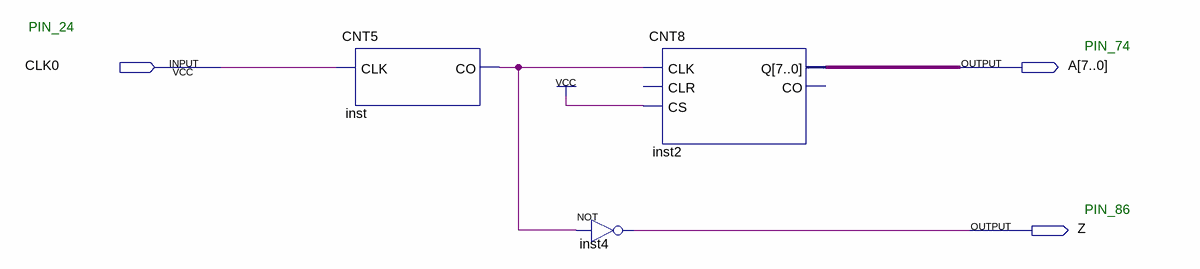
[diagram p0: schematic sheet]
// Quartus schematic sawtooth.bdf as structural Verilog: 3 symbols, 3 pins
module sawtooth (
  input  CLK0,
  output [7:0] A,
  output Z
);

  wire inst_co;

  CNT5 inst (.CLK(CLK0), .CO(inst_co));
  not inst4 (Z, inst_co);
  CNT8 inst2 (.CLK(inst_co), .CS(1'b1), .Q(A));  // open: CLR, CO

  // Notes on the sheet:
  //   PIN_24 
  //   PIN_74 
  //   PIN_86 
endmodule
